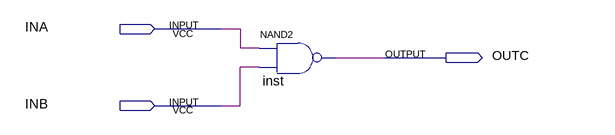
[diagram p0: schematic sheet]
// Quartus schematic Compuerta_NAND.bdf as structural Verilog: 1 symbols, 3 pins
module Compuerta_NAND (
  input  INA,
  input  INB,
  output OUTC
);

  nand inst (OUTC, INA, INB);
endmodule
